# EAGLE schematic learning (EAGLE 9.3.0)
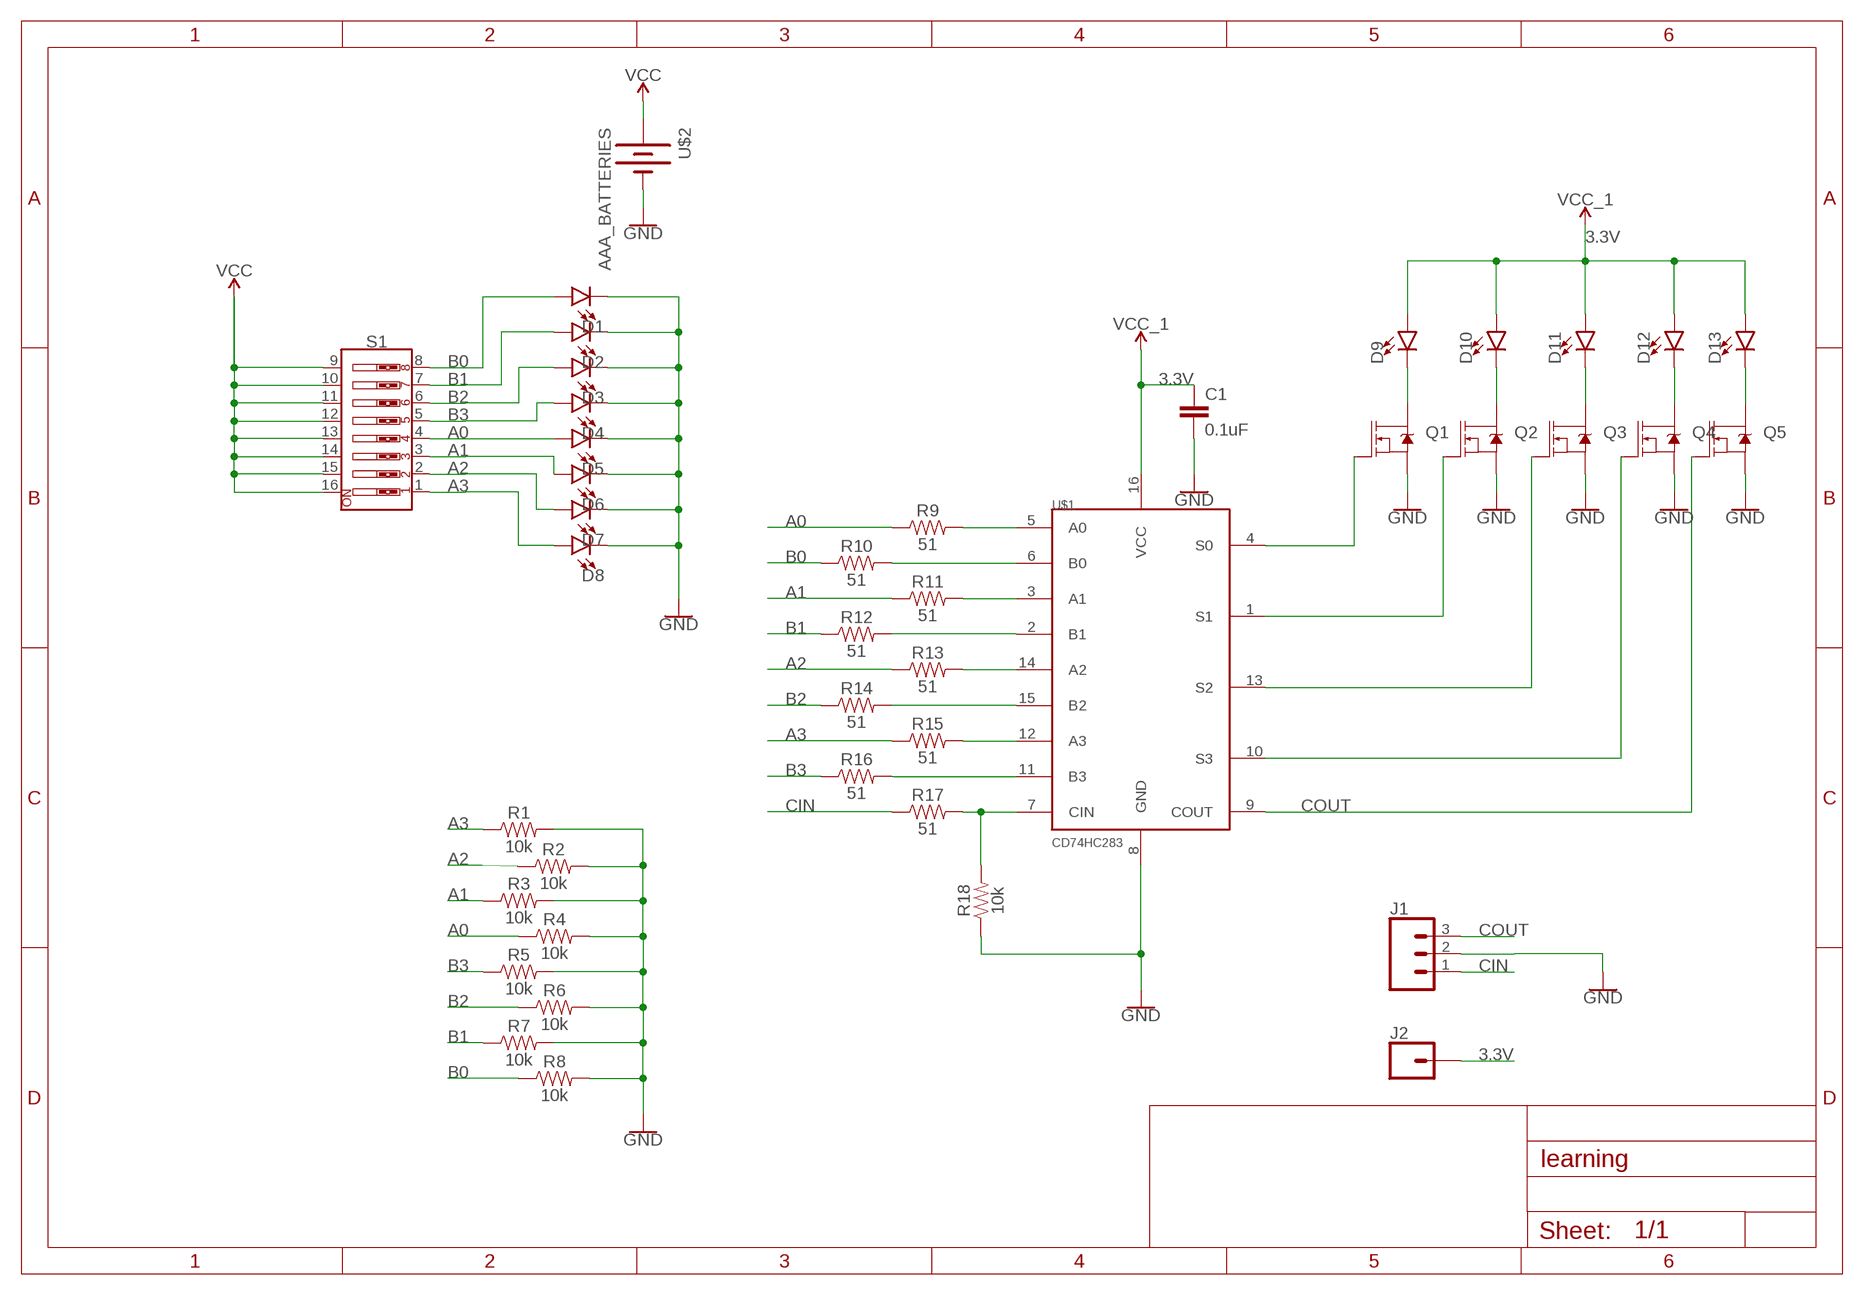
[diagram p0: schematic, sheet 1]

## Parts
C1  0.1uF  0.1UF-0603-25V-5%  [0603]
D1  LED5MM  [LED_5MM]
D2  LED5MM  [LED_5MM]
D3  LED5MM  [LED_5MM]
D4  LED5MM  [LED_5MM]
D5  LED5MM  [LED_5MM]
D6  LED5MM  [LED_5MM]
D7  LED5MM  [LED_5MM]
D8  LED5MM  [LED_5MM]
D9  LED5MM  [LED_5MM]
D10  LED5MM  [LED_5MM]
D11  LED5MM  [LED_5MM]
D12  LED5MM  [LED_5MM]
D13  LED5MM  [LED_5MM]
J1  CONN_03  [1X03]
J2  CONN_01  [1X01]
Q1  MOSFET-NCH-BSS138  [SOT23-3]
Q2  MOSFET-NCH-BSS138  [SOT23-3]
Q3  MOSFET-NCH-BSS138  [SOT23-3]
Q4  MOSFET-NCH-BSS138  [SOT23-3]
Q5  MOSFET-NCH-BSS138  [SOT23-3]
R1  10k  RESISTOR0603  [0603]
R2  10k  RESISTOR0603  [0603]
R3  10k  RESISTOR0603  [0603]
R4  10k  RESISTOR0603  [0603]
R5  10k  RESISTOR0603  [0603]
R6  10k  RESISTOR0603  [0603]
R7  10k  RESISTOR0603  [0603]
R8  10k  RESISTOR0603  [0603]
R9  51  RESISTOR0603  [0603]
R10  51  RESISTOR0603  [0603]
R11  51  RESISTOR0603  [0603]
R12  51  RESISTOR0603  [0603]
R13  51  RESISTOR0603  [0603]
R14  51  RESISTOR0603  [0603]
R15  51  RESISTOR0603  [0603]
R16  51  RESISTOR0603  [0603]
R17  51  RESISTOR0603  [0603]
R18  10k  RESISTOR0603  [0603]
S1  DIP-08-PTH  [DIPSWITCH-08]
U$1  CD74HC283  [SO016]
U$2  AAA_BATTERIES  [WIRE_LEADS]

## Nets
3.3V: C1.1 D9.A D10.A D11.A D12.A D13.A J2.1 U$1.16(VCC) ; supply symbol labelled VCC_1
A0: D5.A R4.1 R9.1 S1.4
A1: D6.A R3.1 R11.1 S1.3
A2: D7.A R2.1 R13.1 S1.2
A3: D8.A R1.1 R15.1 S1.1
B0: D1.A R8.1 R10.1 S1.8
B1: D2.A R7.1 R12.1 S1.7
B2: D3.A R6.1 R14.1 S1.6
B3: D4.A R5.1 R16.1 S1.5
CIN: J1.1 R17.1
COUT: J1.3 Q5.1(G) U$1.9(COUT)
GND: C1.2 D1.K(C) D2.K(C) D3.K(C) D4.K(C) D5.K(C) D6.K(C) D7.K(C) D8.K(C) J1.2 Q1.2(S) Q2.2(S) Q3.2(S) Q4.2(S) Q5.2(S) R1.2 R2.2 R3.2 R4.2 R5.2 R6.2 R7.2 R8.2 R18.1 U$1.8(GND) U$2.P$1(-)
N$1: R10.2 U$1.6(B0)
N$2: R12.2 U$1.2(B1)
N$3: R13.2 U$1.14(A2)
N$4: R15.2 U$1.12(A3)
N$5: R17.2 R18.2 U$1.7(CIN)
N$6: R14.2 U$1.15(B2)
N$7: R9.2 U$1.5(A0)
N$8: R16.2 U$1.11(B3)
N$9: R11.2 U$1.3(A1)
N$10: D9.K(C) Q1.3(D)
N$11: D10.K(C) Q2.3(D)
N$12: D11.K(C) Q3.3(D)
N$13: D12.K(C) Q4.3(D)
N$14: D13.K(C) Q5.3(D)
N$15: Q1.1(G) U$1.4(S0)
N$16: Q2.1(G) U$1.1(S1)
N$17: Q3.1(G) U$1.13(S2)
N$18: Q4.1(G) U$1.10(S3)
VCC: S1.9 S1.10 S1.11 S1.12 S1.13 S1.14 S1.15 S1.16 U$2.P$2(+)

## Library data of the parts
C1 = SparkFun-Capacitors:0.1UF: 0.1µF ceramic capacitors A capacitor is a passive two-terminal electrical component used to store electrical energy temporarily in an electric field.; PROD_ID: CAP-08604
D1-D13 = SparkFun-LED:LED: LED (Generic) Standard schematic elements and footprints for 5mm, 3mm, 1206, and 0603 sized LEDs. Generic LEDs with no color specified.
J1 = SparkFun-Connectors:CONN_03: Multi connection point. Often used as Generic Header-pin footprint for 0.1 inch spaced/style header connections On any of the 0.1 inch spaced packages, you can populate with these: Break Away Headers - Straight <https://www.sparkfun.com/products/116> (PRT-00116) Break Away Male Headers - Right Angle <https://www.sparkfun.com/products/553> (PRT-00553) Female Headers <https://www.sparkfun.com/products/115> (PRT-00115) Break Away Headers - Machine Pin <https://www.sparkfun.com/products/117> (PRT-00117) Break Away Female Headers - Swiss Machine Pin <https://www.sparkfun.com/products/743> (PRT-00743) Stackable Header - 3 Pin (Female, 0.1") <https://www.sparkfun.com/products/13875> (PRT-13875) For SCREWTERMINALS and SPRING TERMINALS visit here: Screw Terimnals on SparkFun.com <https://www.sparkfun.com/search/results?term=Screw+Terminals> (5mm/3.5mm/2.54mm spacing) This device is also useful as a general connection point to wire up your design to another part of your project. Our various solder wires solder well into these plated through hole pads. Hook-Up Wire - Assortment (Stranded, 22 AWG) <https://www.sparkfun.com/products/11375> (PRT-11375) Hook-Up Wire - Assortment (Solid Core, 22 AWG) <https://www.sparkfun.com/products/11367> (PRT-11367) View the entire wire category on our website here <https://www.sparkfun.com/categories/141> Special notes: Molex polarized connector foot print use with SKU : PRT-08232 with associated crimp pins and housings.
J2 = SparkFun-Connectors:CONN_01: Single connection point. Often used as Generic Header-pin footprint for 0.1 inch spaced/style header connections On any of the 0.1 inch spaced packages, you can populate with these: Break Away Headers - Straight <https://www.sparkfun.com/products/116> (PRT-00116) Break Away Male Headers - Right Angle <https://www.sparkfun.com/products/553> (PRT-00553) Female Headers <https://www.sparkfun.com/products/115> (PRT-00115) Break Away Headers - Machine Pin <https://www.sparkfun.com/products/117> (PRT-00117) Break Away Female Headers - Swiss Machine Pin <https://www.sparkfun.com/products/743> (PRT-00743) This device is also useful as a general connection point to wire up your design to another part of your project. Our various solder wires solder well into these plated through hole pads. Hook-Up Wire - Assortment (Stranded, 22 AWG) <https://www.sparkfun.com/products/11375> (PRT-11375) Hook-Up Wire - Assortment (Solid Core, 22 AWG) <https://www.sparkfun.com/products/11367> (PRT-11367) View the entire wire category on our website here <https://www.sparkfun.com/categories/141> Special notes: SMTSO-256-ET is a "flush mount" nut for a 4-40 screw. We mostly use this on specialty testbeds; it is a nice way to connect hardware to your PCB at an adjustable hieght. Also note, the SNAP packages are for using a snappable style connector. We sell a baggie of snaps and they are also used on two LilyPad designs: Snap Assortment - 30 pack (male and female) <https://www.sparkfun.com/products/11347> (DEV-11347) LilyPad Arduino SimpleSnap <https://www.sparkfun.com/products/10941> (DEV-10941) LilyPad SimpleSnap Protoboard <https://www.sparkfun.com/products/10940> (DEV-10940)
Q1-Q5 = SparkFun-DiscreteSemi:MOSFET-NCH: N-channel MOSFETs Voltage controlled devices that allow control of high current outputs. SparkFun Products: SparkFun OpenScale <https://www.sparkfun.com/products/13261> SparkFun Digital Sandbox <https://www.sparkfun.com/products/12651> SparkFun Monster Moto Shield <https://www.sparkfun.com/products/10182> SparkFun MOSFET Power Controller <https://www.sparkfun.com/products/11214>; PROD_ID: TRANS-00830; VALUE: 220mA/50V/3.5Ω
R1-R18 = SparkFun-Resistors:RESISTOR: Generic Resistor Package
S1 = SparkFun-Switches:DIP-08: 8-Position DIP Switch 8-circuit DIP (dual inline package) switch. Commonly used to physcially set a circuit's behavior. SparkFun Products DIP Switch - 8 Position <https://www.sparkfun.com/products/8034> (COM-08034); PROD_ID: SWCH-12197; SF_SKU: COM-08034
U$1 = Soldering Workshop Library:CD74HC283: A 4 bit adder
U$2 = Soldering Workshop Library:AAA_BATTERIES